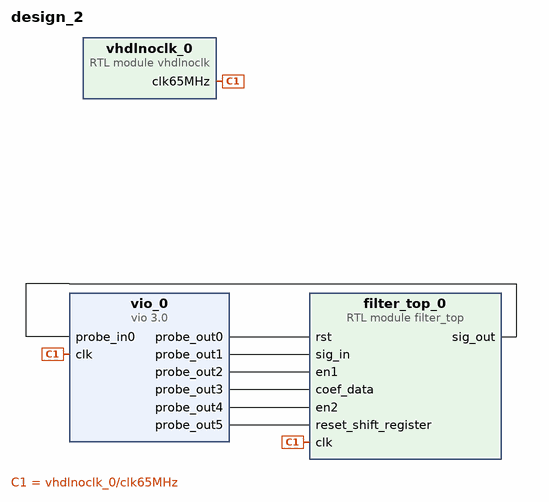
[diagram p0: block diagram of the top level]
# Vivado block design design_2, xc7z010clg400-1, Vivado 2018.2
create_bd_design design_2

create_bd_cell -type module -reference vhdlnoclk vhdlnoclk_0
create_bd_cell -type ip -vlnv xilinx.com:ip:vio:3.0 vio_0
set_property -dict {CONFIG.C_PROBE_OUT3_WIDTH 18 CONFIG.C_PROBE_OUT1_WIDTH 25 CONFIG.C_NUM_PROBE_OUT 6} [get_bd_cells vio_0]
create_bd_cell -type module -reference filter_top filter_top_0
set_property -dict [list \
  CONFIG.sig_width 25 \
  CONFIG.coef_width 18 \
  CONFIG.nbr_coef 40 \
  CONFIG.log2_nbr_coef 6 \
] [get_bd_cells filter_top_0]

# ---- connections ----

connect_bd_net [get_bd_pins vhdlnoclk_0/clk65MHz] [get_bd_pins vio_0/clk] [get_bd_pins filter_top_0/clk]
connect_bd_net [get_bd_pins filter_top_0/sig_out] [get_bd_pins vio_0/probe_in0]
connect_bd_net [get_bd_pins vio_0/probe_out0] [get_bd_pins filter_top_0/rst]
connect_bd_net [get_bd_pins vio_0/probe_out1] [get_bd_pins filter_top_0/sig_in]
connect_bd_net [get_bd_pins vio_0/probe_out2] [get_bd_pins filter_top_0/en1]
connect_bd_net [get_bd_pins vio_0/probe_out3] [get_bd_pins filter_top_0/coef_data]
connect_bd_net [get_bd_pins vio_0/probe_out4] [get_bd_pins filter_top_0/en2]
connect_bd_net [get_bd_pins vio_0/probe_out5] [get_bd_pins filter_top_0/reset_shift_register]

validate_bd_design
save_bd_design
